# EAGLE design FT232R-Breakout_v37 (EAGLE 7.2.0)
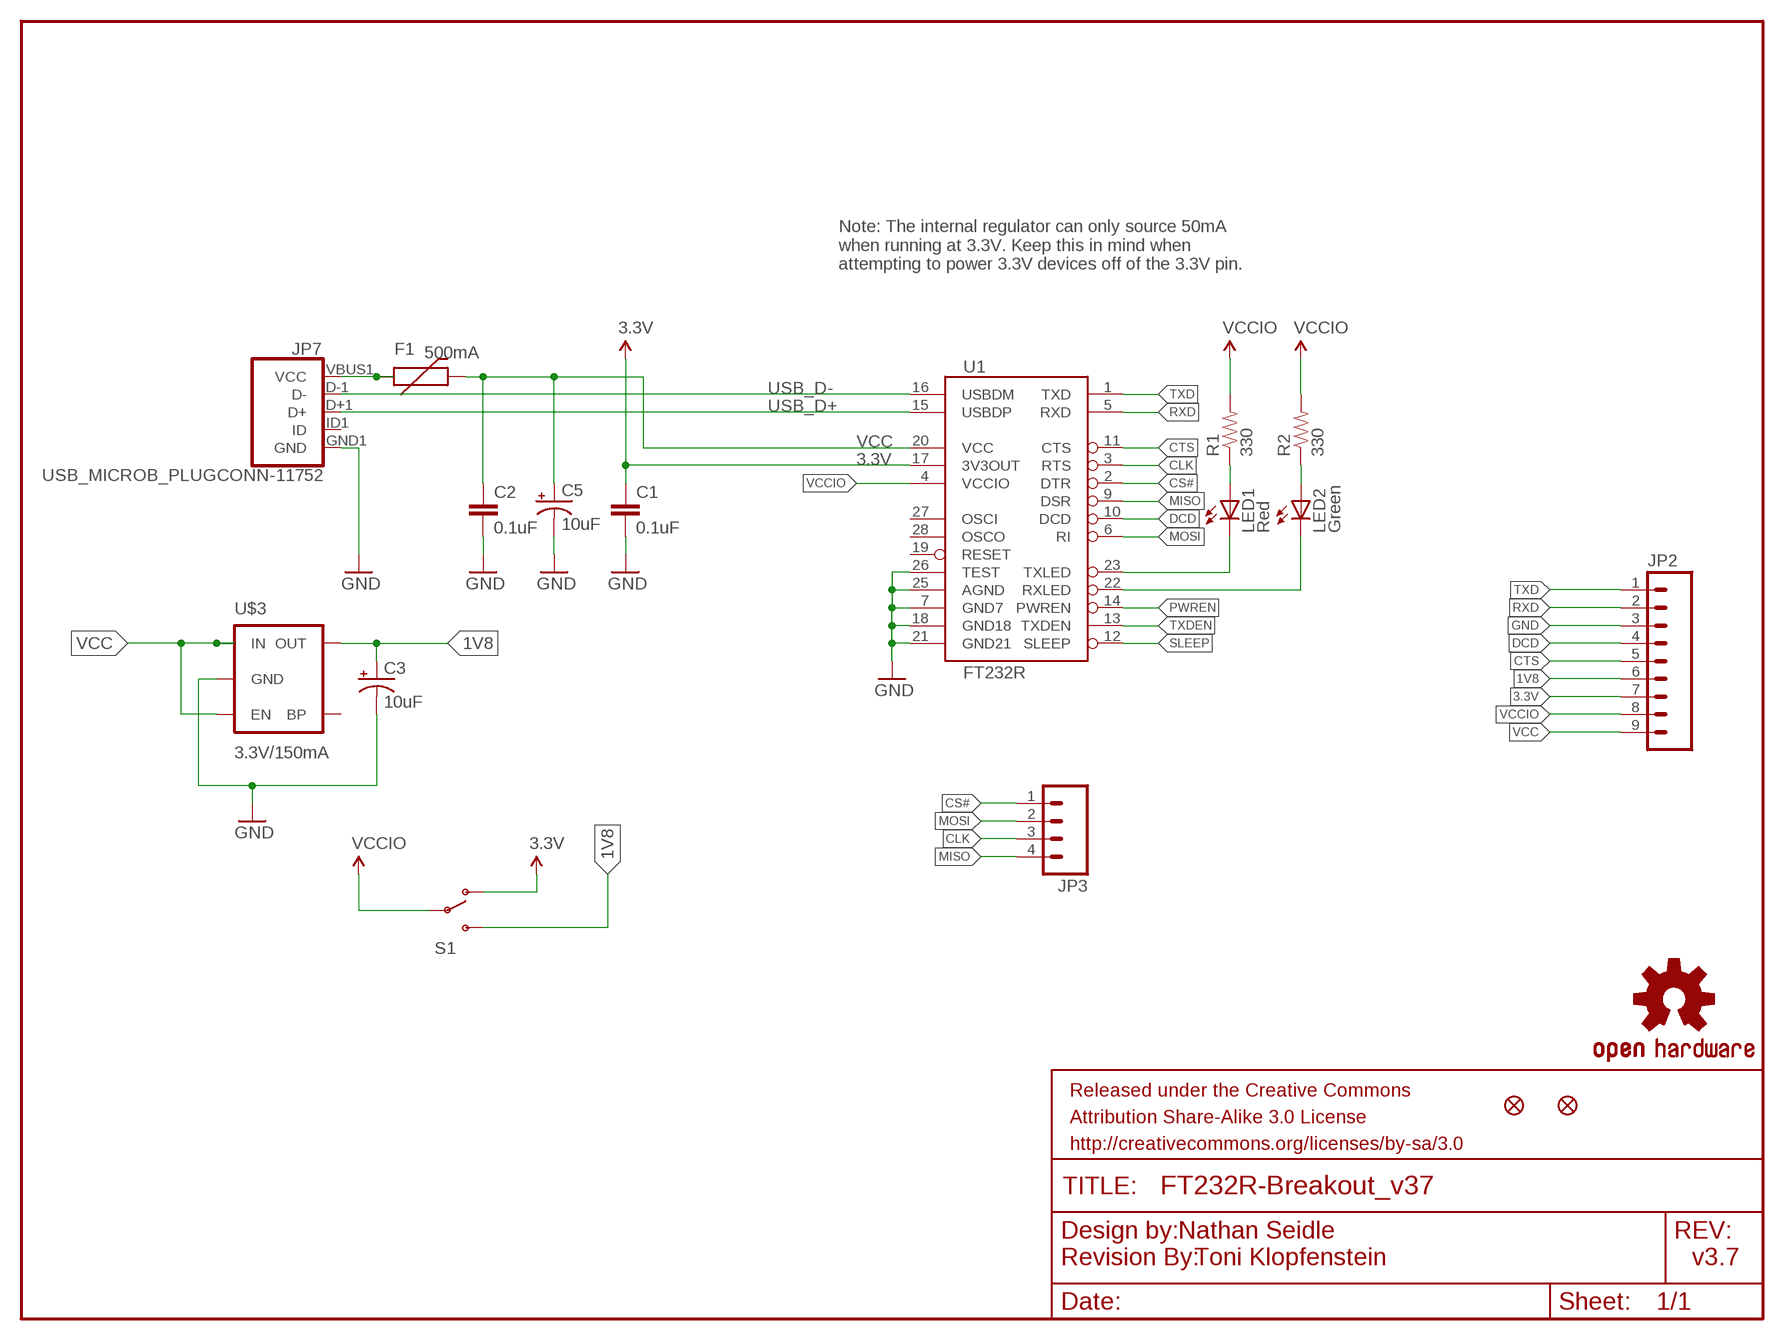
[diagram p0: schematic, sheet 1]

## Parts
C1  0.1uF  0.1UF-25V(+80/-20%)(0603)  [0603-CAP]
C2  0.1uF  0.1UF-25V(+80/-20%)(0603)  [0603-CAP]
C3  10uF  10UF-16V-10%(TANT)  [EIA3216]
C5  10uF  10UF-16V-10%(TANT)  [EIA3216]
F1  500mA  PTCSMD  [PTC-1206]
FRAME1  FRAME-LETTER  [CREATIVE_COMMONS]
JP2  M09  [1X09]
JP3  M04PTH  [1X04]
JP5  FIDUCIAL1X2  [FIDUCIAL-1X2]
JP6  FIDUCIAL1X2  [FIDUCIAL-1X2]
JP7  USB_MICROB_PLUGCONN-11752  [USB-B-MICRO-SMD_V03]
LED1  Red  LED-RED0603  [LED-0603]
LED2  Green  LED-GREEN0603  [LED-0603]
LOGO1  OSHW-LOGOS  [OSHW-LOGO-S]
R1  330  330OHM1/10W1%(0603)  [0603-RES]
R2  330  330OHM1/10W1%(0603)  [0603-RES]
S1  SWITCH-SPDTSMD  [AYZ0202]
U1  FT232R  FT232RLSSOP  [SSOP28DB]
U$1  REVISION  [REVISION]
U$3  3.3V/150mA  V_REG_MIC52053.3V  [SOT23-5]

## Nets
1V8: C3.A(+) JP2.6 S1.3(S) U$3.5(OUT)
3.3V [power]: C1.1 JP2.7 S1.1(O) U1.17(3V3OUT)
CLK: JP3.3 U1.3(RTS)
CS#: JP3.1 U1.2(DTR)
CTS: JP2.5 U1.11(CTS)
DCD: JP2.4 U1.10(DCD)
GND [power]: C1.2 C2.2 C3.C(-) C5.C(-) JP2.3 JP7.GND1(GND) U1.7(GND7) U1.18(GND18) U1.21(GND21) U1.25(AGND) U1.26(TEST) U$3.2(GND)
MISO: JP3.4 U1.9(DSR)
MOSI: JP3.2 U1.6(RI)
N$1: LED1.A R1.1
N$2: LED2.A R2.1
N$3: F1.1 JP7.VBUS1(VCC)
PWREN: U1.14(PWREN)
RXD: JP2.2 U1.5(RXD)
RXLED: LED2.C U1.22(RXLED)
SLEEP: U1.12(SLEEP)
TXD: JP2.1 U1.1(TXD)
TXDEN: U1.13(TXDEN)
TXLED: LED1.C U1.23(TXLED)
USB_D+: JP7.D+1(D+) U1.15(USBDP)
USB_D-: JP7.D-1(D-) U1.16(USBDM)
VCC [power]: C2.1 C5.A(+) F1.2 JP2.9 U1.20(VCC) U$3.1(IN) U$3.3(EN)
VCCIO: JP2.8 R1.2 R2.2 S1.2(P) U1.4(VCCIO)
Unconnected: JP7.ID1(ID) U1.19(RESET) U1.27(OSCI) U1.28(OSCO) U$3.4(BP)

## Notes on the sheet
- Note: The internal regulator can only source 50mA
  when running at 3.3V. Keep this in mind when
  attempting to power 3.3V devices off of the 3.3V pin.
- Nathan Seidle
- Toni Klopfenstein | v3.7

## Library data of the parts
C1 C2 = SparkFun-Capacitors:0.1UF-25V(+80/-20%)(0603): CAP-00810 Ceramic Standard decoupling cap; PROD_ID: CAP-00810
C3 C5 = SparkFun-Capacitors:10UF-16V-10%(TANT): CAP-00811 1206/EIA-3216 Tantalum capacitor; PROD_ID: CAP-00811
F1 = SparkFun-PowerIC:PTC: Resettable Fuse PTC Resettable Fuse. Spark Fun Electronics SKU : COM-08357; PROD_ID: RES-11150
FRAME1 = SparkFun-Aesthetics:FRAME-LETTER: Schematic Frame Standard 8.5x11 US Letter frame
JP2 = SparkFun:M09: Header 9 Standard 9-pin 0.1" header. Use with straight break away headers (SKU : PRT-00116), right angle break away headers (PRT-00553), swiss pins (PRT-00743), machine pins (PRT-00117), and female headers (PRT-00115).
JP3 = SparkFun:M04: Header 4 Standard 4-pin 0.1" header. Use with straight break away headers (SKU : PRT-00116), right angle break away headers (PRT-00553), swiss pins (PRT-00743), machine pins (PRT-00117), and female headers (PRT-00115). Molex polarized connector foot print use with SKU : PRT-08231 with associated crimp pins and housings.
JP5 JP6 = SparkFun:FIDUCIAL: Fiducial Alignment Points Various fiducial points for machine vision alignment.
JP7 = SparkFun-Connectors:USB_MICROB_PLUG: USB Micro-B Plug Comes in a variety of packages. Check out Hirose's ZX-x0 line: http://www.hirose.co.jp/cataloge_hp/e24200011.pdf; PROD_ID: CONN-11752
LED1 = SparkFun-LED:LED-RED: Assorted Red LEDs LilyPad 1206- DIO-09912 1206- DIO-00809 0603- DIO-00819; PROD_ID: DIO-00819; VALUE: RED
LED2 = SparkFun-LED:LED-GREEN: Various green LEDs 0603- DIO-00821 LARGE- DIO-00862 LILYPAD- DIO-09910; PROD_ID: DIO-00821; VALUE: GREEN
LOGO1 = SparkFun-Aesthetics:OSHW-LOGO: Open Source Hardware Logo This logo indicates the piece of hardware it is found on incorporates a OSHW license and/or adheres to the definition of open source hardware found here: http://freedomdefined.org/OSHW
R1 R2 = SparkFun-Resistors:330OHM1/10W1%(0603): RES-00818; PROD_ID: RES-00818
S1 = SparkFun-Electromechanical:SWITCH-SPDT: SPDT Switch Simple slide switch, Spark Fun Electronics SKU : COM-00102 DPDT SMT slide switch, AYZ0202, SWCH-08179; PROD_ID: SWCH-08179
U1 = SparkFun:FT232RL: USB UART FT232RL 4th Generation USB UART (USB <-> Serial) Controller. Spark Fun Electronics SKU : COM-00650
U$1 = SparkFun-Aesthetics:REVISION
U$3 = SparkFun-PowerIC:V_REG_MIC5205: V_REG MIC5219 Standard 3.3V and 5V 150mA LDO voltage regulator in SOT-23 layout. Micrel part MIC5205. BP (by-pass) pin is used to lower output noise with 470pF cap, may be left open.; PROD_ID: VREG-00822

## Net classes
0 default: width 0.203 mm
1 power: width 0.254 mm

## Board
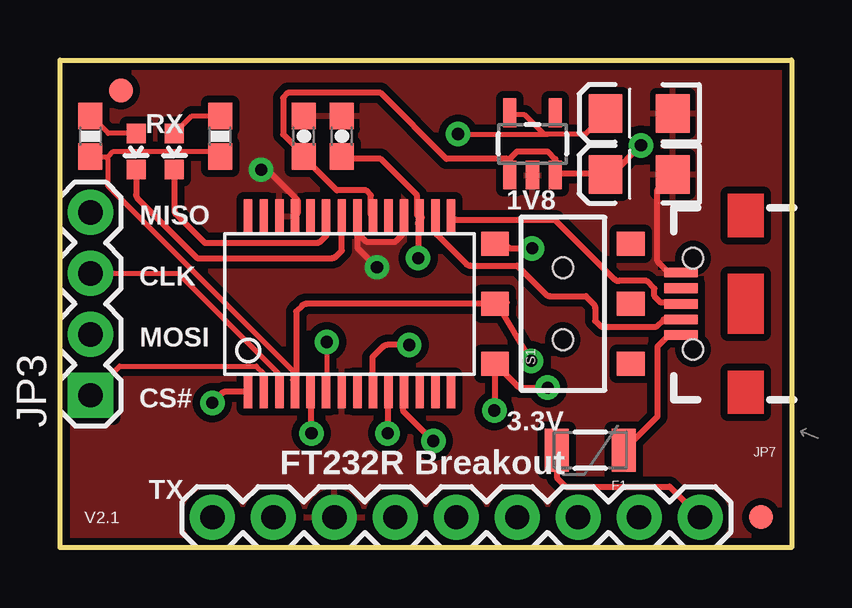
[diagram p1: board, top side]
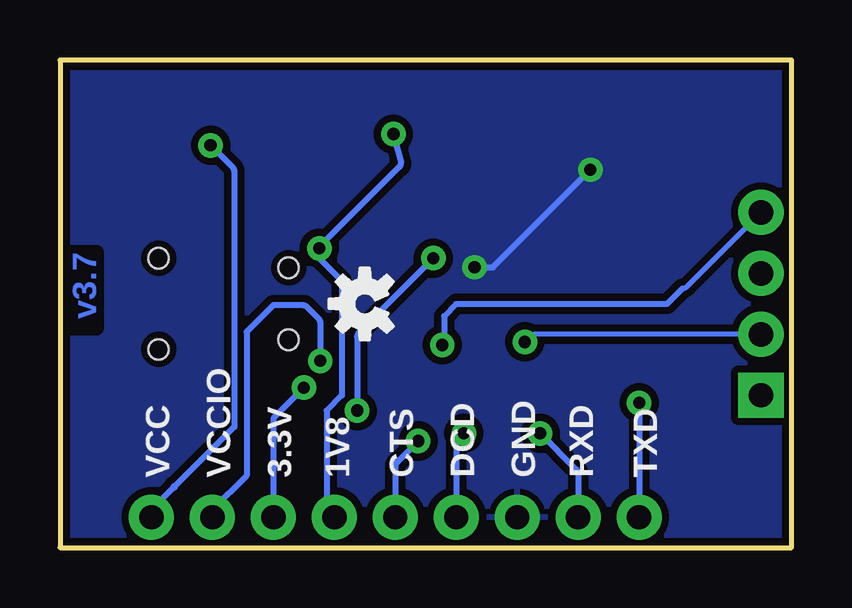
[diagram p2: board, bottom side, seen from below]

Size 30.48 x 20.32 mm. Coordinates in mm from the lower left corner, seen from the top.
Outline: 0,20.32 30.48,20.32 30.48,0 0,0 0,20.32
Copper layers (1*16): Top 0.035mm / dielectric 1.5mm / Bottom 0.035mm
Design rules "SparkFun": minimum track width 8mil, minimum drill 20mil, track to track 8mil, track to pad 8mil, pad to pad 8mil, via to via 8mil, smd to smd 8mil, copper to edge 8mil, drill to drill 8mil, minimum pad ring 12mil, minimum via ring 10mil, stop-mask expansion 4mil, vias tented up to drill 20mil, thermal gap 10mil

### Footprints (pad centres in the part's own frame; a part is rotated, then mirrored left to right if it is on the bottom)
0603-CAP = smd 1.1 x 1: 1 -0.85,0; 2 0.85,0
EIA3216 = smd 1.4 x 1.6: A 1.4,0; C -1.4,0
PTC-1206 = smd 1 x 1.8: 1 -1.4,0; 2 1.4,0
1X09 = drill 1.016 pad 1.88: 1 0,0; 2 2.54,0; 3 5.08,0; 4 7.62,0; 5 10.16,0; 6 12.7,0; 7 15.24,0; 8 17.78,0; 9 20.32,0
1X04 = drill 1.016 pad 1.88 square: 1 0,0 | drill 1.016 pad 1.88: 2 2.54,0; 3 5.08,0; 4 7.62,0
FIDUCIAL-1X2 = smd 1 x 1: 1 0,0
USB-B-MICRO-SMD_V03 = smd 1.4 x 0.4: D+1 2.7,0; D-1 2.7,0.65; GND1 2.7,-1.3; ID1 2.7,-0.65; VBUS1 2.7,1.3 | hole 0.85: 2.2,1.9; 2.2,-1.9
LED-0603 = smd 0.8 x 0.8: A 0,-0.75; C 0,0.75
0603-RES = smd 1.1 x 1: 1 -0.85,0; 2 0.85,0
AYZ0202 = smd 1 x 1.15: 1 -2.5,2.825; 2 0,2.825; 3 2.5,2.825; 4 -2.5,-2.825; 5 0,-2.825; 6 2.5,-2.825 | hole 0.85: 1.5,0; -1.5,0
SSOP28DB = smd 0.348 x 1.397: 1 -4.225,-3.656; 2 -3.575,-3.656; 3 -2.925,-3.656; 4 -2.275,-3.656; 5 -1.625,-3.656; 6 -0.975,-3.656; 7 -0.325,-3.656; 8 0.325,-3.656; 9 0.975,-3.656; 10 1.625,-3.656; 11 2.275,-3.656; 12 2.925,-3.656; 13 3.575,-3.656; 14 4.225,-3.656; 15 4.225,3.656; 16 3.575,3.656; 17 2.925,3.656; 18 2.275,3.656; 19 1.625,3.656; 20 0.975,3.656; 21 0.325,3.656; 22 -0.325,3.656; 23 -0.975,3.656; 24 -1.625,3.656; 25 -2.275,3.656; 26 -2.925,3.656; 27 -3.575,3.656; 28 -4.225,3.656
SOT23-5 = smd 0.55 x 1.2: 1 -0.95,-1.3; 2 0,-1.3; 3 0.95,-1.3; 4 0.95,1.3; 5 -0.95,1.3

### Placement (x,y rotation side)
C1  11.75,17.14 90 top
C2  10.16,17.14 90 top
C3  24.13,18.1 180 top
C5  24.13,15.56 180 top
F1  22.1,4.06 180 top
FRAME1  1.66,-10.16 0 top  (outside the outline)
JP2  6.35,1.27 0 top
JP3  1.27,6.35 90 top
JP5  29.21,1.27 0 top
JP6  2.54,19.05 0 top
JP7  28.57,10.16 180 top
LED1  4.76,16.51 180 top
LED2  3.18,16.51 180 top
LOGO1  17.78,10.16 90 bottom
R1  6.67,17.14 270 top
R2  1.27,17.14 270 top
S1  20.96,10.16 90 top
U1  12.07,10.16 0 top
U$1  12.7,-12.7 0 top  (outside the outline)
U$3  19.68,16.83 0 top

### Tracks (layer width: path | path; a pad name or v marks a point on that pad's centre or on a via)
1V8  (via drill 0.51)
  Top 0.203: 20.32,17.22 21.89,17.22 22.71,18.03 C3.A | 20.32,17.22 20.17,17.22 19.36,18.03 18.75,18.03 U$3.5 | 18.54,12.65 S1.3 | v16.59,17.23 20.32,17.22
  Top 0.254: 18.54,12.65 18.64,12.55 arc45 18.82,12.47 v19.67,12.47
  Bottom 0.203: JP2.6 19.25,1.47
  Bottom 0.254: JP2.6 19.37,1.59 19.37,5.71 18.73,6.35 18.73,11.11 19.6,11.98 arc45 19.67,12.16 v19.67,12.47 arc90 19.7,12.45 19.76,12.45 16.34,15.86 arc-45 16.27,16.04 v16.59,17.23
3.3V  (via drill 0.51)
  Top 0.254: 18.03,7.67 S1.1 | S1.1 19.05,6.74 arc45 19.23,6.67 v20.32,6.67 | v14.92,12.07 14.92,13.5 arc-45 15,13.68 15.09,13.77 U1.17 14.88,13.87 14.88,14.68 13.36,16.21 11.84,16.21 C1.1 | v18.1,5.71 arc45 18.13,5.79 S1.1
  Bottom 0.254: v20.32,6.67 21.52,5.47 arc-45 21.59,5.29 JP2.7 | v14.92,12.07 18.02,8.96 arc-45 18.1,8.79 v18.1,5.71
CLK
  Top 0.203: JP3.3 4.93,11.43 9.09,7.26 9.09,6.55 U1.3
CS#
  Top 0.203: JP3.1 2.49,7.57 8.18,7.57 8.48,7.26 8.48,6.55 U1.2
CTS  (via drill 0.51)
  Top 0.254: U1.11 arc45 14.29,6.38 14.29,5.71 v15.56,4.45
  Bottom 0.254: v15.56,4.45 16.44,3.57 arc-45 16.51,3.39 JP2.5
DCD  (via drill 0.51)
  Top 0.203: 13.65,6.47 U1.10
  Top 0.254: 13.65,6.47 v13.65,4.76
  Bottom 0.254: v13.65,4.76 13.9,4.52 arc-45 13.97,4.34 JP2.4
GND  (via drill 0.51)
  Top 0.254: C1.2 11.74,18.03 11.62,18.03 | U1.18 14.28,13.77 14.28,13.06 13.97,12.75 12.75,12.75 12.45,13.06 12.45,13.77 U1.21 12.39,12.5 v13.21,11.68 | JP7.GND1 25.37,11.46 24.89,11.94 24.89,14.92 C5.C | v8.38,15.75 8.64,15.75 9.91,14.48 9.91,13.93 U1.25
  Bottom 0.254: v13.21,11.68 12.45,11.68 v8.38,15.75
  pour Bottom (isolate 0.305): 0,0 0,20.32 30.48,20.32 30.48,0
  pour Top (isolate 0.305): 0,0 0,20.32 30.48,20.32 30.48,0
MISO  (via drill 0.51)
  Top 0.203: 12.95,7.26 12.95,6.55 U1.9
  Top 0.254: v14.55,8.45 13.63,8.45 arc45 13.45,8.37 13.02,7.94 13.02,6.56 arc45 U1.9
  Bottom 0.203: 1.58,13.97 JP3.4 4.37,10.87 arc45 4.55,10.79
  Bottom 0.254: 4.55,10.79 5.19,10.16 13.97,10.16 14.48,9.65 14.48,8.52 v14.55,8.45
MOSI  (via drill 0.51)
  Top 0.203: v11.11,8.57 11.11,6.56 arc-45 U1.6
  Bottom 0.203: JP3.2 10.69,8.89 arc-45 10.87,8.82 v11.11,8.57
N$1
  Top 0.203: LED1.A 5.5,18 R1.1
N$2
  Top 0.203: LED2.A 2,17.26 R2.1
N$3
  Top 0.254: JP7.VBUS1 25.37,8.86 24.89,8.38 24.89,5.46 F1.1
RXD  (via drill 0.51)
  Top 0.254: U1.5 10.44,4.85 arc45 v10.48,4.76
  Bottom 0.254: v10.48,4.76 8.96,3.25 arc45 8.89,3.07 JP2.2
RXLED
  Top 0.254: LED2.C 3.18,14.71 arc45 3.25,14.53 5.71,12.07 11.33,12.07 arc45 11.5,12.14 11.75,12.38 11.75,13.8 arc45 U1.22
TXD  (via drill 0.51)
  Top 0.254: U1.1 6.93,6.5 arc45 6.75,6.43 v6.35,6.03
  Bottom 0.254: v6.35,6.03 JP2.1
TXLED
  Top 0.254: LED1.C 4.76,14.08 arc45 4.84,13.9 6.03,12.7 10.69,12.7 arc45 10.87,12.77 11.11,13.02 11.11,13.76 arc45 U1.23
USB_D+
  Top 0.203: 16.31,13.77 U1.15 | 25.86,10.21 JP7.D+1
  Top 0.254: 25.86,10.21 25.03,10.21 24.77,10.48 24.77,10.79 24.45,11.11 23.28,11.11 arc-45 23.1,11.19 20.64,13.65 16.56,13.65 arc-45 16.38,13.73 U1.15
USB_D-
  Top 0.203: 15.7,13.06 15.7,13.77 U1.16 | 25.15,9.5 25.86,9.5 JP7.D-1
  Top 0.254: 25.15,9.5 24.85,9.21 22.54,9.21 22.3,9.45 22.3,9.98 arc45 22.23,10.16 21.91,10.48 20.43,10.48 arc-45 20.25,10.55 19.05,11.75 17.11,11.75 arc-45 16.93,11.82 15.7,13.06
VCC  (via drill 0.51)
  Top 0.254: C5.A 22.71,15.6 20.68,15.6 U$3.3 arc45 U$3.3 20.64,16.19 20.32,16.51 19.05,16.51 18.81,16.27 arc27 18.75,16.17 | 22.81,15.49 C5.A | U$3.1 18.73,16.09 arc-18 18.75,16.17 | U1.20 12.95,13.87 12.95,14.68 12.75,14.88 11.53,14.88 10.21,16.21 C2.1 10.11,16.41 9.3,17.22 9.3,18.75 9.5,18.95 13.36,18.95 16.1,16.21 18.64,16.21 18.75,16.17 | C5.A 22.5,15.49 22.83,15.49 arc45 23.01,15.57 v24.21,16.76 | F1.2 20.7,2.92 21.08,2.54 25.4,2.54 JP2.9
  Bottom 0.254: JP2.9 26.67,1.58 25.71,2.53 23.22,5.03 23.22,15.67 arc-45 23.29,15.85 v24.21,16.76
  Bottom 0.305: 25.72,2.54 25.71,2.53
VCCIO  (via drill 0.51)
  Top 0.203: R2.2 2.01,16.3 | 2.01,16.3 2.22,16.51 6.45,16.51 R1.2 | U1.4 9.7,6.55 9.7,6.99 9.7,7.37 1.98,15.09 1.98,16.21 2.01,16.3 | 18.64,10.21 18.24,10.21 S1.2
  Top 0.254: 9.7,6.99 9.77,7.05 arc45 9.84,7.23 9.84,9.84 10.09,10.09 arc-45 10.27,10.16 S1.2 arc-45 18.27,10.1 v19.63,7.79
  Bottom 0.254: JP2.8 24.13,1.58 22.71,3 22.71,8.99 21.59,10.11 20.37,10.11 arc45 20.2,10.04 19.71,9.55 arc45 19.63,9.37 v19.63,7.79

### Text on the board
Bottom: v3.7
tPlace: RX | MISO | 1V8 | CLK | MOSI | CS# | 3.3V | FT232R Breakout | TX | V2.1
bPlace: TXD | RXD | GND | DCD | CTS | 1V8 | 3.3V | VCCIO | VCC
tDocu: Nathan Seidle | Toni Klopfenstein